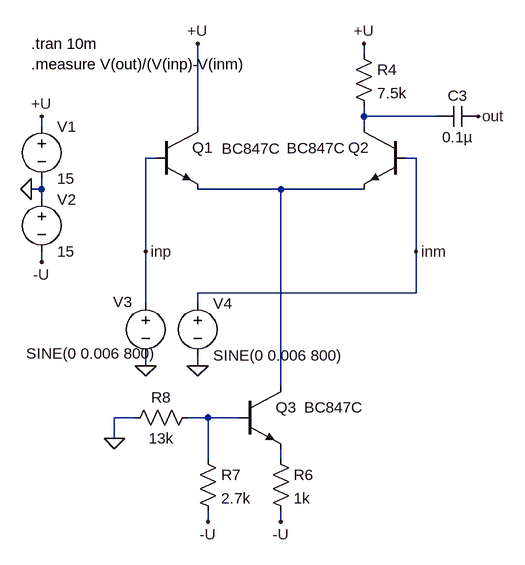
[diagram p0: schematic current-src.asc]
current-src.asc, the LTspice schematic file:
Version 4
SHEET 1 880 744
WIRE 544 -48 544 -64
WIRE 544 48 544 32
WIRE 656 48 544 48
WIRE 48 64 48 48
WIRE 288 64 288 -64
WIRE 544 64 544 48
WIRE 224 112 208 112
WIRE 624 112 608 112
WIRE 48 160 48 144
WIRE 48 160 32 160
WIRE 416 160 288 160
WIRE 544 160 416 160
WIRE 48 176 48 160
WIRE 208 256 208 112
WIRE 624 256 624 112
WIRE 48 272 48 256
WIRE 624 320 624 256
WIRE 624 320 288 320
WIRE 208 336 208 256
WIRE 288 336 288 320
WIRE 208 432 208 416
WIRE 288 432 288 416
WIRE 416 464 416 160
WIRE 192 512 160 512
WIRE 304 512 272 512
WIRE 352 512 304 512
WIRE 160 544 160 512
WIRE 304 576 304 512
WIRE 416 576 416 560
WIRE 304 672 304 656
WIRE 416 672 416 656
FLAG 32 160 0
FLAG 48 48 +U
FLAG 48 272 -U
FLAG 288 -64 +U
FLAG 544 -64 +U
FLAG 720 48 out
FLAG 208 256 inp
FLAG 624 256 inm
FLAG 208 432 0
FLAG 288 432 0
FLAG 416 672 -U
FLAG 304 672 -U
FLAG 160 544 0
SYMBOL voltage 48 48 R0
WINDOW 123 0 0 Left 2
WINDOW 39 0 0 Left 2
SYMATTR InstName V1
SYMATTR Value 15
SYMBOL voltage 48 160 R0
WINDOW 123 0 0 Left 2
WINDOW 39 0 0 Left 2
SYMATTR InstName V2
SYMATTR Value 15
SYMBOL npn 224 64 R0
WINDOW 3 101 34 Left 2
SYMATTR InstName Q1
SYMATTR Value BC847C
SYMBOL npn 608 64 M0
WINDOW 3 92 33 Left 2
SYMATTR InstName Q2
SYMATTR Value BC847C
SYMBOL res 528 -64 R0
SYMATTR InstName R4
SYMATTR Value 7.5k
SYMBOL voltage 208 320 R0
WINDOW 0 -50 14 Left 2
WINDOW 3 -184 93 Left 2
WINDOW 123 0 0 Left 2
WINDOW 39 0 0 Left 2
SYMATTR InstName V3
SYMATTR Value SINE(0 0.006 800)
SYMBOL voltage 288 320 R0
WINDOW 123 0 0 Left 2
WINDOW 39 0 0 Left 2
SYMATTR InstName V4
SYMATTR Value SINE(0 0.006 800)
SYMBOL cap 720 32 R90
WINDOW 0 0 32 VBottom 2
WINDOW 3 32 32 VTop 2
SYMATTR InstName C3
SYMATTR Value 0.1µ
SYMBOL npn 352 464 R0
WINDOW 3 100 32 Left 2
SYMATTR InstName Q3
SYMATTR Value BC847C
SYMBOL res 400 560 R0
SYMATTR InstName R6
SYMATTR Value 1k
SYMBOL res 288 560 R0
SYMATTR InstName R7
SYMATTR Value 2.7k
SYMBOL res 288 496 R90
WINDOW 0 0 56 VBottom 2
WINDOW 3 32 56 VTop 2
SYMATTR InstName R8
SYMATTR Value 13k
TEXT 32 -64 Left 2 !.tran 10m
TEXT 32 -32 Left 2 !.measure V(out)/(V(inp)-V(inm)

The netlist it stands for:
* current-src.asc
V1 +U 0 15
V2 0 -U 15
Q1 +U inp N002 0 BC847C
Q2 N001 inm N002 0 BC847C
R4 +U N001 7.5k
V3 inp 0 SINE(0 0.006 800)
V4 inm 0 SINE(0 0.006 800)
C3 out N001 0.1µ
Q3 N002 N003 N004 0 BC847C
R6 N004 -U 1k
R7 N003 -U 2.7k
R8 N003 0 13k
.model NPN NPN
.model PNP PNP
.lib standard.bjt
.tran 10m
.measure V(out)/(V(inp)-V(inm)
.backanno
.end